# Altium schematic sheet ESP32_Core.SchDoc
size A4; SheetNumber: 3; SheetTotal: 6
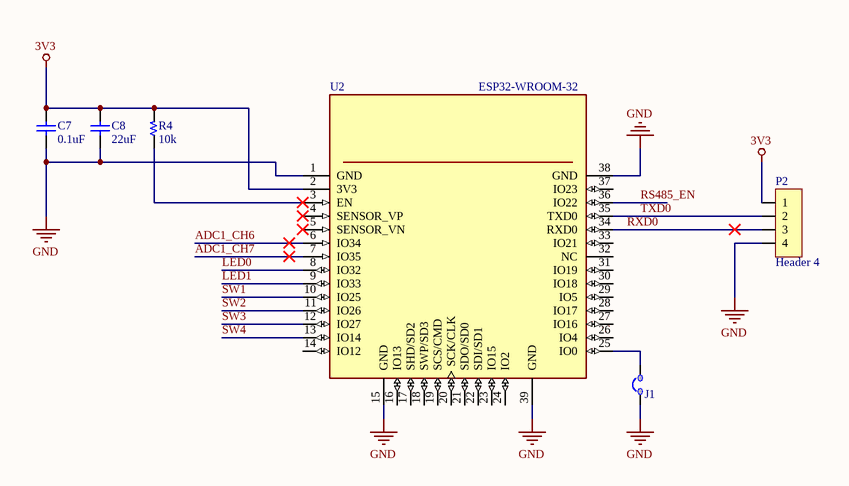
[diagram p0: ESP32_Core.SchDoc]

## Parts
C7  0.1uF  [C 0805]
C8  22uF  [C 0805]
J1  JUMP 2  [JUMP/2/Close]  (value not drawn)  (no BOM)
P2  Header 4  [HDR/Header/4]
R4  10k  [R 0805]
U2  ESP32-WROOM-32  [MODULE_ESP32-WROOM-32]

## Nets
3V3: C7.1 C8.1 P2.1 R4.2 U2.2(3V3)
GND: C7.2 C8.2 J1.1 P2.4 U2.1(GND) U2.15(GND) U2.38(GND) U2.39(GND)
ADC1_CH6: U2.6(IO34)
ADC1_CH7: U2.7(IO35)
LED0: U2.8(IO32)
LED1: U2.9(IO33)
RS485_EN: U2.36(IO22)
RXD0: P2.3 U2.34(RXD0)
SW1: U2.10(IO25)
SW2: U2.11(IO26)
SW3: U2.12(IO27)
SW4: U2.13(IO14)
TXD0: P2.2 U2.35(TXD0)
NetJ1_2: J1.2 U2.25(IO0)
NetR4_1: R4.1 U2.3(EN)

Not connected (* = marked no-connect by the designer): U2 4(SENSOR_VP)* 5(SENSOR_VN)* 14(IO12) 16(IO13) 17(SHD/SD2) 18(SWP/SD3) 19(SCS/CMD) 20(SCK/CLK) 21(SDO/SD0) 22(SDI/SD1) 23(IO15) 24(IO2) 26(IO4) 27(IO16) 28(IO17) 29(IO5) 30(IO18) 31(IO19) 32(NC) 33(IO21) 37(IO23)

## Library data of the parts
C7 C8 = Capacitor NP: Capacitor non-pol
P2 = Header 4: Header, 4-Pin
R4 = Resistor
U2 = ESP32-WROOM-32: Bluetooth, WiFi 802.11b/g/n, Bluetooth v4.2 + EDR, Class 1, 2 and 3 Transceiver Module 2.4GHz ~ 2.5GHz Integrated, Trace Surface Mount; MF: Espressif Systems; MP: ESP32-WROOM-32D; Price: None; Package: Module Espressif Systems; Availability: Unavailable; SnapEDA_Link: https://www.snapeda.com/parts/ESP32-WROOM-32D/Espressif%20Systems/view-part/2768115/?ref=snap; Value: *